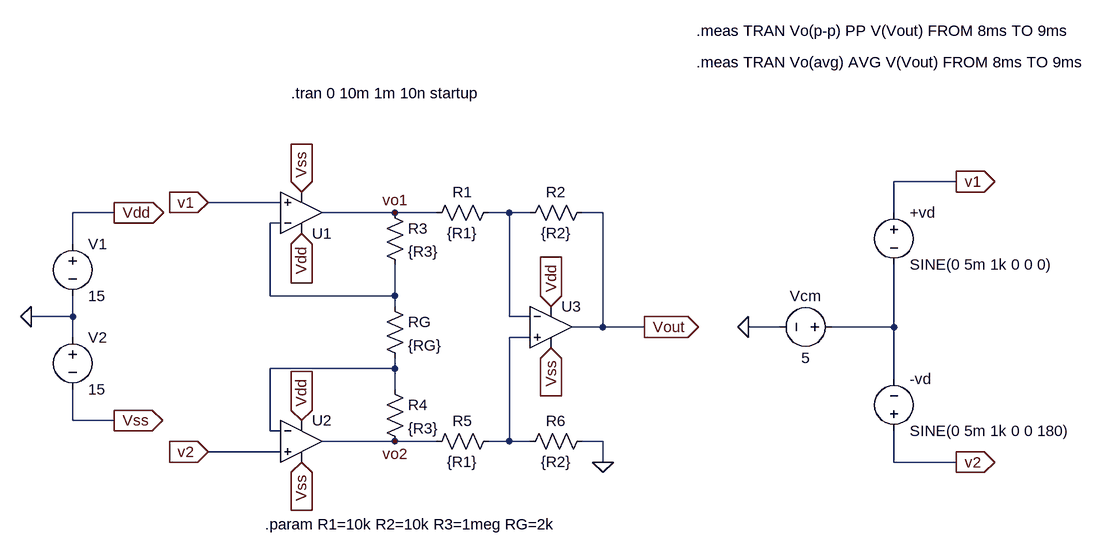
[diagram p0: schematic instrumentation_amplifier_ideal.asc]
instrumentation_amplifier_ideal.asc, the LTspice schematic file:
Version 4
SHEET 1 1448 680
WIRE 1216 -48 1120 -48
WIRE 176 -16 64 -16
WIRE -80 0 -144 0
WIRE 352 0 240 0
WIRE 416 0 352 0
WIRE 528 0 496 0
WIRE 560 0 528 0
WIRE 672 0 640 0
WIRE 1120 0 1120 -48
WIRE 176 16 160 16
WIRE -144 48 -144 0
WIRE 160 128 160 16
WIRE 352 128 352 80
WIRE 352 128 160 128
WIRE 352 144 352 128
WIRE -144 160 -144 128
WIRE -144 160 -208 160
WIRE 528 160 528 0
WIRE 560 160 528 160
WIRE 672 176 672 0
WIRE 672 176 624 176
WIRE 736 176 672 176
WIRE 944 176 896 176
WIRE 1120 176 1120 80
WIRE 1120 176 1024 176
WIRE -144 192 -144 160
WIRE 560 192 528 192
WIRE 352 240 352 224
WIRE 352 240 160 240
WIRE 1120 256 1120 176
WIRE 352 272 352 240
WIRE -144 320 -144 272
WIRE -80 320 -144 320
WIRE 160 336 160 240
WIRE 176 336 160 336
WIRE 352 352 240 352
WIRE 416 352 352 352
WIRE 528 352 528 192
WIRE 528 352 496 352
WIRE 560 352 528 352
WIRE 672 352 640 352
WIRE 176 368 64 368
WIRE 672 384 672 352
WIRE 1120 384 1120 336
WIRE 1216 384 1120 384
FLAG 672 384 0
FLAG -208 160 0
FLAG -80 0 Vdd
IOPIN -80 0 Out
FLAG 208 -32 Vss
IOPIN 208 -32 In
FLAG -80 320 Vss
IOPIN -80 320 Out
FLAG 208 32 Vdd
IOPIN 208 32 In
FLAG 896 176 0
FLAG 1216 -48 v1
IOPIN 1216 -48 Out
FLAG 1216 384 v2
IOPIN 1216 384 Out
FLAG 64 -16 v1
IOPIN 64 -16 In
FLAG 64 368 v2
IOPIN 64 368 In
FLAG 736 176 Vout
IOPIN 736 176 Out
FLAG 592 208 Vss
IOPIN 592 208 In
FLAG 592 144 Vdd
IOPIN 592 144 In
FLAG 208 384 Vss
IOPIN 208 384 In
FLAG 208 320 Vdd
IOPIN 208 320 In
FLAG 352 0 vo1
FLAG 352 352 vo2
SYMBOL res 336 -16 R0
SYMATTR InstName R3
SYMATTR Value {R3}
SYMBOL res 336 256 R0
SYMATTR InstName R4
SYMATTR Value {R3}
SYMBOL res 336 128 R0
SYMATTR InstName RG
SYMATTR Value {RG}
SYMBOL res 512 -16 R90
WINDOW 0 0 56 VBottom 2
WINDOW 3 32 56 VTop 2
SYMATTR InstName R1
SYMATTR Value {R1}
SYMBOL res 656 -16 R90
WINDOW 0 0 56 VBottom 2
WINDOW 3 32 56 VTop 2
SYMATTR InstName R2
SYMATTR Value {R2}
SYMBOL res 512 336 R90
WINDOW 0 0 56 VBottom 2
WINDOW 3 32 56 VTop 2
SYMATTR InstName R5
SYMATTR Value {R1}
SYMBOL res 656 336 R90
WINDOW 0 0 56 VBottom 2
WINDOW 3 32 56 VTop 2
SYMATTR InstName R6
SYMATTR Value {R2}
SYMBOL voltage -144 32 R0
WINDOW 123 0 0 Left 0
WINDOW 39 0 0 Left 0
SYMATTR InstName V1
SYMATTR Value 15
SYMBOL voltage -144 176 R0
WINDOW 123 0 0 Left 0
WINDOW 39 0 0 Left 0
SYMATTR InstName V2
SYMATTR Value 15
SYMBOL voltage 1040 176 R90
WINDOW 0 -32 56 VBottom 2
WINDOW 3 32 56 VTop 2
SYMATTR InstName Vcm
SYMATTR Value 5
SYMBOL voltage 1120 -16 R0
WINDOW 123 0 0 Left 0
WINDOW 39 0 0 Left 0
SYMATTR InstName +vd
SYMATTR Value SINE(0 5m 1k 0 0 0)
SYMBOL voltage 1120 352 M180
WINDOW 0 24 96 Left 2
WINDOW 3 24 16 Left 2
WINDOW 123 0 0 Left 0
WINDOW 39 0 0 Left 0
SYMATTR InstName -vd
SYMATTR Value SINE(0 5m 1k 0 0 180)
SYMBOL OpAmps\\UniversalOpamp2 208 0 M180
SYMATTR InstName U1
SYMBOL OpAmps\\UniversalOpamp2 208 352 R0
SYMATTR InstName U2
SYMBOL OpAmps\\UniversalOpamp2 592 176 R0
SYMATTR InstName U3
TEXT 152 480 Left 2 !.param R1=10k R2=10k R3=1meg RG=2k
TEXT 192 -184 Left 2 !.tran 0 10m 1m 10n startup
TEXT 816 -280 Left 2 !.meas TRAN Vo(p-p) PP V(Vout) FROM 8ms TO 9ms
TEXT 816 -232 Left 2 !.meas TRAN Vo(avg) AVG V(Vout) FROM 8ms TO 9ms

The netlist it stands for:
* instrumentation_amplifier_ideal.asc
R3 vo1 N002 {R3}
R4 N005 vo2 {R3}
RG N002 N005 {RG}
R1 N001 vo1 {R1}
R2 Vout N001 {R2}
R5 N004 vo2 {R1}
R6 0 N004 {R2}
V1 Vdd 0 15
V2 0 Vss 15
Vcm N003 0 5
V§+vd v1 N003 SINE(0 5m 1k 0 0 0)
V§-vd v2 N003 SINE(0 5m 1k 0 0 180)
XU1 v1 N002 Vdd Vss vo1 level.2 Avol=1Meg GBW=10Meg Slew=10Meg ilimit=25m rail=0 Vos=0 phimargin=45 en=0 enk=0 in=0 ink=0 Rin=500Meg  ; pins IN+ IN- V+ V- OUT
XU2 v2 N005 Vdd Vss vo2 level.2 Avol=1Meg GBW=10Meg Slew=10Meg ilimit=25m rail=0 Vos=0 phimargin=45 en=0 enk=0 in=0 ink=0 Rin=500Meg  ; pins IN+ IN- V+ V- OUT
XU3 N004 N001 Vdd Vss Vout level.2 Avol=1Meg GBW=10Meg Slew=10Meg ilimit=25m rail=0 Vos=0 phimargin=45 en=0 enk=0 in=0 ink=0 Rin=500Meg  ; pins IN+ IN- V+ V- OUT
.param R1=10k R2=10k R3=1meg RG=2k
.tran 0 10m 1m 10n startup
.meas TRAN Vo(p-p) PP V(Vout) FROM 8ms TO 9ms
.meas TRAN Vo(avg) AVG V(Vout) FROM 8ms TO 9ms
.lib UniversalOpamps2.sub
.backanno
.end